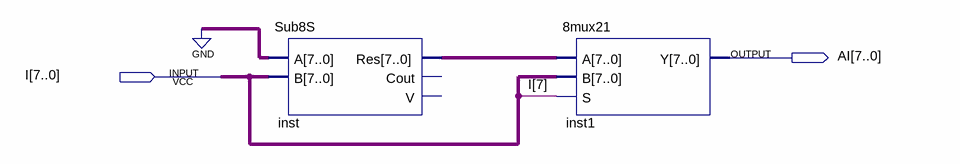
[diagram p0: schematic sheet]
// Quartus schematic AVU.bdf as structural Verilog: 2 symbols, 2 pins
module AVU (
  input  [7:0] I,
  output [7:0] AI
);

  wire [7:0] inst_res;

  Sub8S inst (.A({8{1'b0}}), .B(I), .Res(inst_res));  // open: Cout, V
  \8mux21  inst1 (.A(inst_res), .B(I), .S(I[7]), .Y(AI));
endmodule
